# EAGLE design Main (EAGLE 7.5.0)
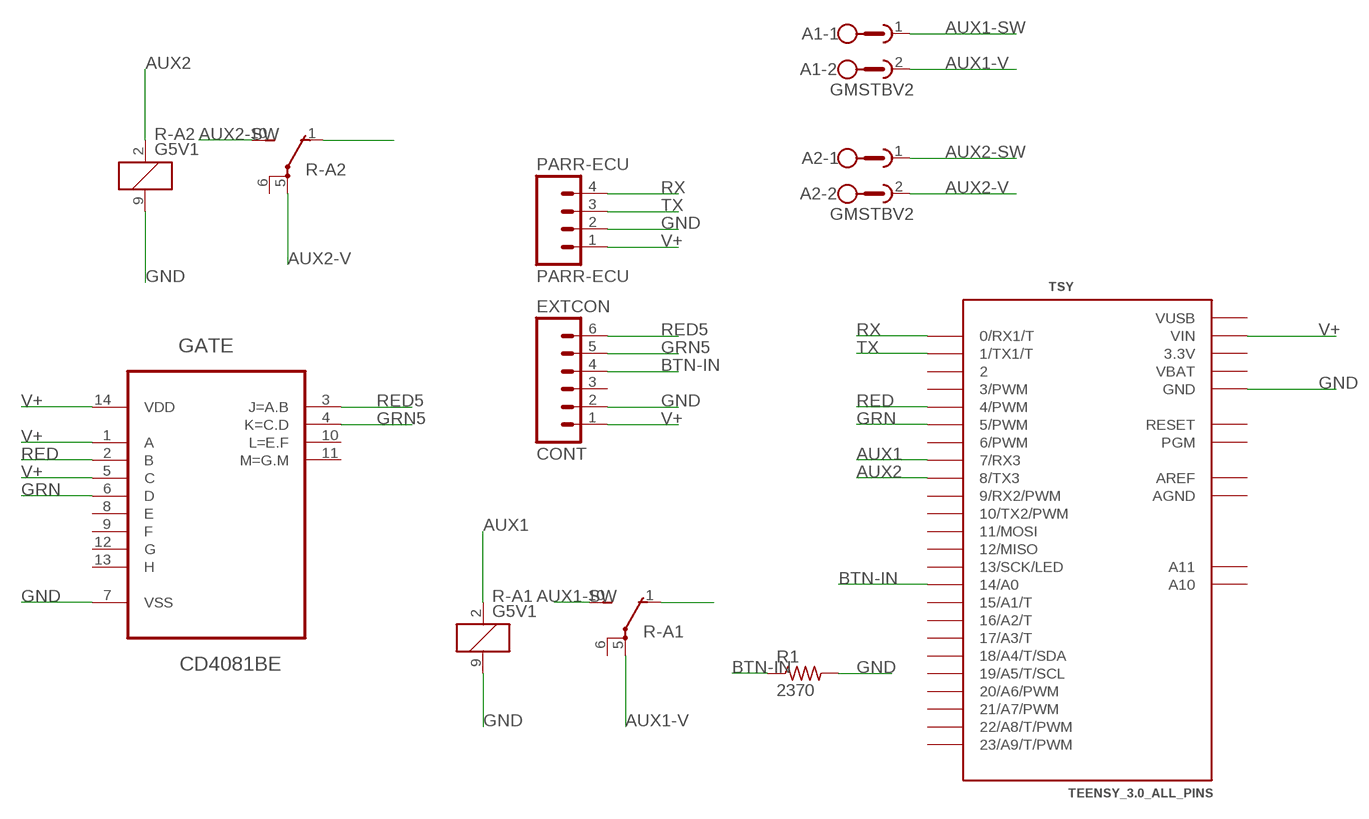
[diagram p0: schematic, sheet 1]

## Parts
A1  GMSTBV2  [GMSTBV2]
A2  GMSTBV2  [GMSTBV2]
EXTCON  CONT  M06NO_SILK_FEMALE_PTH  [1X06_NO_SILK]
GATE  CD4081BE  [DIP254P762X508-14]
PARR-ECU  PARR-ECU  M04NO_SILK_ALL_ROUND  [1X04_NO_SILK_ALL_ROUND]
R1  2370  R-US_0207/10  [0207/10]
R-A1  G5V1  [G5V1]
R-A2  G5V1  [G5V1]
TSY  TEENSY_3.0_ALL_PINS  [TEENSY_3.0-3.2&LC_ALL_PINS]

## Nets
AUX1: R-A1.2 TSY.7(7/RX3)
AUX1-SW: A1.1 R-A1.10(2:S)
AUX1-V: A1.2 R-A1.5(2:P)
AUX2: R-A2.2 TSY.8(8/TX3)
AUX2-SW: A2.1 R-A2.10(2:S)
AUX2-V: A2.2 R-A2.5(2:P)
BTN-IN: EXTCON.4 R1.1 TSY.14/A0
GND: EXTCON.2 GATE.7(VSS) PARR-ECU.2 R1.2 R-A1.9 R-A2.9 TSY.GND TSY.GND1(GND)
GRN: GATE.6(D) TSY.5(5/PWM)
GRN5: EXTCON.5 GATE.4(K=C.D)
N$4: R-A1.1(2:O)
N$8: R-A2.1(2:O)
RED: GATE.2(B) TSY.4(4/PWM)
RED5: EXTCON.6 GATE.3(J=A.B)
RX: PARR-ECU.4 TSY.0(0/RX1/T)
TX: PARR-ECU.3 TSY.1(1/TX1/T)
V+: EXTCON.1 GATE.1(A) GATE.5(C) GATE.14(VDD) PARR-ECU.1 TSY.VIN
Unconnected: EXTCON.3 GATE.8(E) GATE.9(F) GATE.10(L=E.F) GATE.11(M=G.M) GATE.12(G) GATE.13(H) R-A1.6(2:P) R-A2.6(2:P) TSY.2 TSY.3(3/PWM) TSY.6(6/PWM) TSY.9(9/RX2/PWM) TSY.10(10/TX2/PWM) TSY.11(11/MOSI) TSY.12(12/MISO) TSY.13(13/SCK/LED) TSY.15/A1(15/A1/T) TSY.16/A2(16/A2/T) TSY.17/A3(17/A3/T) TSY.18/A4(18/A4/T/SDA) TSY.19/A5(19/A5/T/SCL) TSY.20/A6(20/A6/PWM) TSY.21/A7(21/A7/PWM) TSY.22/A8(22/A8/T/PWM) TSY.23/A9(23/A9/T/PWM) TSY.A10 TSY.A11 TSY.PGM TSY.RESET/DAC(RESET)

## Power pins joined to a net without a drawn wire
3.3V: TSY.3.3V TSY.3.3V1(3.3V)
AGND: TSY.AGND
AREF: TSY.AREF
VBAT: TSY.VBAT
VUSB: TSY.VUSB

## Library data of the parts
A1 A2 = con-phoenix-762:GMSTBV2: PHOENIX; MPN: GMSTBVA2,5/2-G-7,62; OC_FARNELL: 1793079; OC_NEWARK: 69R9520
EXTCON = SparkFun-Connectors:M06: Header 6 Standard 6-pin 0.1" header. Use with straight break away headers (SKU : PRT-00116), right angle break away headers (PRT-00553), swiss pins (PRT-00743), machine pins (PRT-00117), and female headers (PRT-00115). Molex polarized connector foot print use with SKU : PRT-08094 with associated crimp pins and housings. NOTES ON THE VARIANTS LOCK and LOCK_LONGPADS... This footprint was designed to help hold the alignment of a through-hole component (i.e. 6-pin header) while soldering it into place. You may notice that each hole has been shifted either up or down by 0.005 of an inch from it's more standard position (which is a perfectly straight line). This slight alteration caused the pins (the squares in the middle) to touch the edges of the holes. Because they are alternating, it causes a "brace" to hold the component in place. 0.005 has proven to be the perfect amount of "off-center" position when using our standard breakaway headers. Although looks a little odd when you look at the bare footprint, once you have a header in there, the alteration is very hard to notice. Also,if you push a header all the way into place, it is covered up entirely on the bottom side. This idea of altering the position of holes to aid alignment will be further integrated into the Sparkfun Library for other footprints. It can help hold any component with 3 or more connection pins.; PROD_ID: CONN-08437
GATE = Texas Instruments_By_element14_Batch_1:CD4081BE: CMOS AND Gates; MPN: CD4081BE; OC_FARNELL: 1106116; OC_NEWARK: 60K5134; PACKAGE: PDIP-14; SUPPLIER: Texas Instruments
PARR-ECU = SparkFun-Connectors:M04: Header 4 Standard 4-pin 0.1" header. Use with straight break away headers (SKU : PRT-00116), right angle break away headers (PRT-00553), swiss pins (PRT-00743), machine pins (PRT-00117), and female headers (PRT-00115). Molex polarized connector foot print use with SKU : PRT-08231 with associated crimp pins and housings. 1MM SMD Version SKU: PRT-10208; PROD_ID: CONN-09696
R1 = resistor:R-US_: RESISTOR, American symbol
R-A1 R-A2 = relay:G5V1: RELAY 1 x switch, 0.5 A/125 V AC, 1 A/24 V DC , Omron; MPN: G5V-1-DC24; OC_FARNELL: 9949593; OC_NEWARK: 36M6377
TSY = Teensy_3_and_LC_Series_Boards_v1.4:TEENSY_3.0_ALL_PINS: Teensy 3.0 board, showing all pins that are easily acessible.

## Board
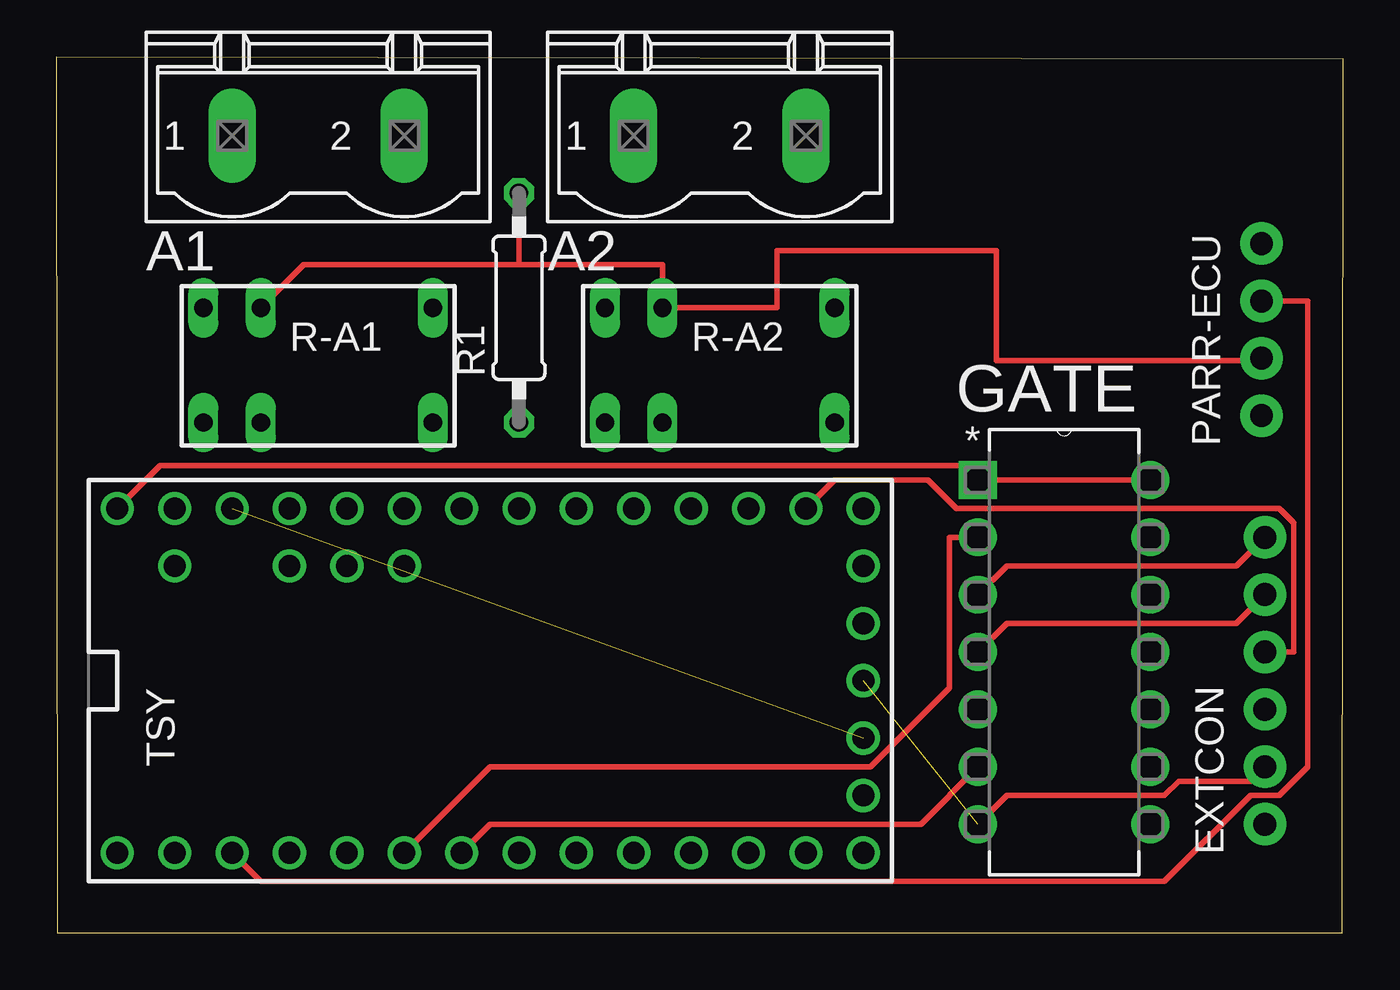
[diagram p1: board, top side]
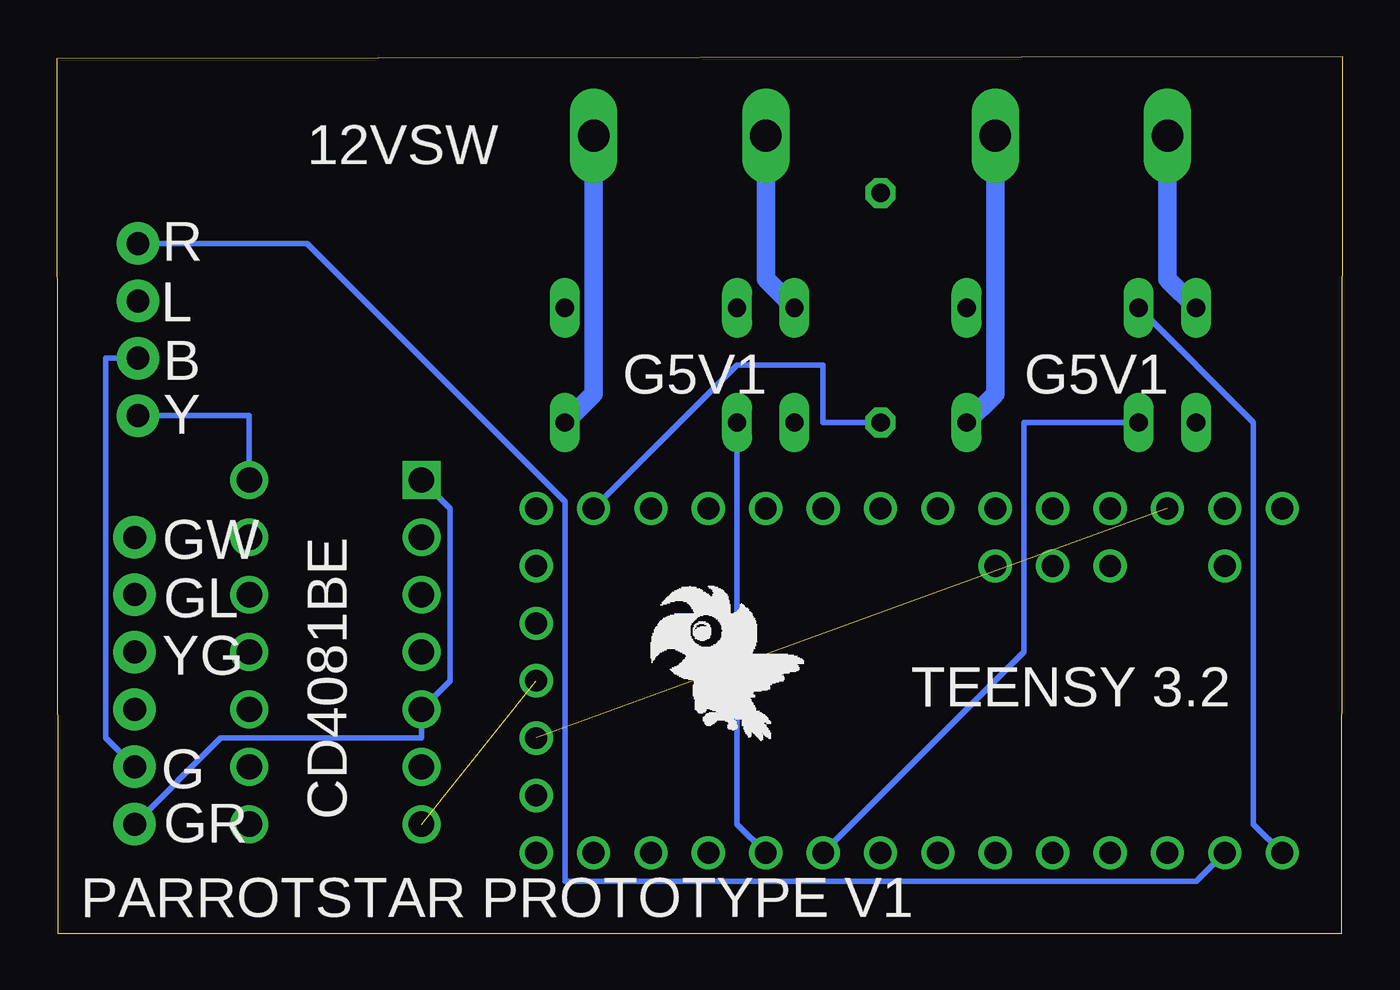
[diagram p2: board, bottom side, seen from below]

Size 56.95 x 38.81 mm. Coordinates in mm from the lower left corner, seen from the top.
Outline: 0,38.81 56.95,38.71 56.9,0 0.05,0 0,38.81
Copper layers (1*16): Top 0.035mm / dielectric 1.5mm / Bottom 0.035mm
Design rules "default": minimum track width 10mil, minimum drill 24mil, track to track 8mil, track to pad 8mil, pad to pad 8mil, via to via 8mil, smd to smd 8mil, copper to edge 40mil, drill to drill 8mil, minimum pad ring 10mil, minimum via ring 8mil, stop-mask expansion 4mil, vias tented up to drill 0mil, thermal gap 10mil

### Footprints (pad centres in the part's own frame; a part is rotated, then mirrored left to right if it is on the bottom)
GMSTBV2 = drill 1.397 long: 1 -3.81,0; 2 3.81,0
1X06_NO_SILK = drill 1.016 pad 1.88: 1 0,0; 2 2.54,0; 3 5.08,0; 4 7.62,0; 5 10.16,0; 6 12.7,0
DIP254P762X508-14 = drill 1.118 square: 1 -7.62,15.24 | drill 1.118: 2 -7.62,12.7; 3 -7.62,10.16; 4 -7.62,7.62; 5 -7.62,5.08; 6 -7.62,2.54; 7 -7.62,0; 8 0,0; 9 0,2.54; 10 0,5.08; 11 0,7.62; 12 0,10.16; 13 0,12.7; 14 0,15.24
1X04_NO_SILK_ALL_ROUND = drill 1.016 pad 1.88: 1 0,0; 2 2.54,0; 3 5.08,0; 4 7.62,0
0207/10 = drill 0.813 octagon: 1 -5.08,0; 2 5.08,0
G5V1 = drill 0.813 long: 1 -5.08,-2.54; 2 -2.54,-2.54; 5 5.08,-2.54; 6 5.08,2.54; 9 -2.54,2.54; 10 -5.08,2.54
TEENSY_3.0-3.2&LC_ALL_PINS = drill 0.965: 0 -7.62,13.97; 1 -7.62,11.43; 2 -7.62,8.89; 3 -7.62,6.35; 3.3V 7.62,11.43; 3.3V1 -2.54,-16.51; 4 -7.62,3.81; 5 -7.62,1.27; 6 -7.62,-1.27; 7 -7.62,-3.81; 8 -7.62,-6.35; 9 -7.62,-8.89; 10 -7.62,-11.43; 11 -7.62,-13.97; 12 -7.62,-16.51; 13 7.62,-16.51; 14/A0 7.62,-13.97; 15/A1 7.62,-11.43; 16/A2 7.62,-8.89; 17/A3 7.62,-6.35; 18/A4 7.62,-3.81; 19/A5 7.62,-1.27; 20/A6 7.62,1.27; 21/A7 7.62,3.81; 22/A8 7.62,6.35; 23/A9 7.62,8.89; A10 5.08,6.35; A11 5.08,3.81; AGND 7.62,13.97; AREF 5.08,8.89; GND -7.62,16.51; GND1 0,-16.51; PGM 2.54,-16.51; RESET/DAC 5.08,-16.51; VBAT -5.08,-16.51; VIN 7.62,16.51; VUSB 5.08,13.97

### Placement (x,y rotation side)
A1  11.58,35.31 0 top
A2  29.36,35.31 0 top
EXTCON  53.49,4.83 90 top
GATE  48.41,4.83 0 top
PARR-ECU  53.34,22.91 90 top
R1  20.47,27.69 90 top
R-A1  11.58,25.15 0 top
R-A2  29.36,25.15 0 top
TSY  19.2,11.18 90 top

### Tracks (layer width: path | path; a pad name or v marks a point on that pad's centre or on a via)
3.3V  (1 unrouted)
AUX1
  Bottom 0.254: R-A1.2 14.12,22.61 14.12,12.45 TSY.7
AUX1-SW
  Bottom 0.813: R-A1.10 7.77,28.96 A1.1
AUX1-V
  Bottom 0.813: R-A1.5 15.39,23.88 A1.2
AUX2
  Bottom 0.254: TSY.8 26.82,4.83 R-A2.2
AUX2-SW
  Bottom 0.813: A2.1 25.55,28.96 R-A2.10
AUX2-V
  Bottom 0.813: R-A2.5 33.17,23.88 A2.2
BTN-IN
  Top 0.254: TSY.14/A0 34.44,20.07 38.57,20.07 39.84,18.8 54.13,18.8 54.76,18.16 54.76,12.45 EXTCON.4
  Bottom 0.254: R1.1 23.01,22.61 23.01,25.15 26.82,25.15 TSY.14/A0
GND  (1 unrouted)
  Top 0.254: EXTCON.2 52.86,6.73 49.68,6.73 49.05,6.1 42.06,6.1 GATE.7 | R-A1.9 10.95,29.59 20.47,29.59 | 20.47,29.59 26.82,29.59 R-A2.9 31.9,27.69 31.9,30.23 41.61,30.23 41.61,25.35 53.34,25.35 PARR-ECU.2 | R1.2 20.47,29.59
  Bottom 0.254: PARR-ECU.2 54.76,25.45 54.76,8.64 EXTCON.2 | TSY.GND 3.96,4.83 3.96,22.61 R-A1.9
GRN
  Top 0.254: TSY.5 19.2,4.83 38.25,4.83 GATE.6
GRN5
  Top 0.254: GATE.4 42.06,13.72 52.22,13.72 EXTCON.5
RED
  Top 0.254: TSY.4 19.2,7.37 36.03,7.37 39.52,10.86 39.52,17.53 GATE.2
RED5
  Top 0.254: GATE.3 42.06,16.26 52.22,16.26 EXTCON.6
RX
  Bottom 0.254: TSY.0 6.5,2.29 34.44,2.29 34.44,19.11 45.86,30.53 PARR-ECU.4
TX
  Top 0.254: TSY.1 9.04,2.29 49.05,2.29 52.86,6.1 54.13,6.1 55.4,7.37 55.4,27.99 PARR-ECU.3
V+
  Top 0.254: TSY.VIN 4.6,20.7 40.16,20.7 GATE.1 GATE.14
  Bottom 0.254: GATE.1 39.52,18.8 39.52,11.18 GATE.5 40.79,8.64 49.68,8.64 EXTCON.1 | PARR-ECU.1 48.41,22.91 GATE.14

### Text on the board
bNames: 12VSW | R | L | B | G5V1 | G5V1 | Y | CD4081BE | GW | GL | YG | TEENSY 3.2 | G | GR | PARROTSTAR PROTOTYPE V1